# Altium schematic sheet Serwo.SchDoc
size A4; SheetNumber: 4; SheetTotal: 7
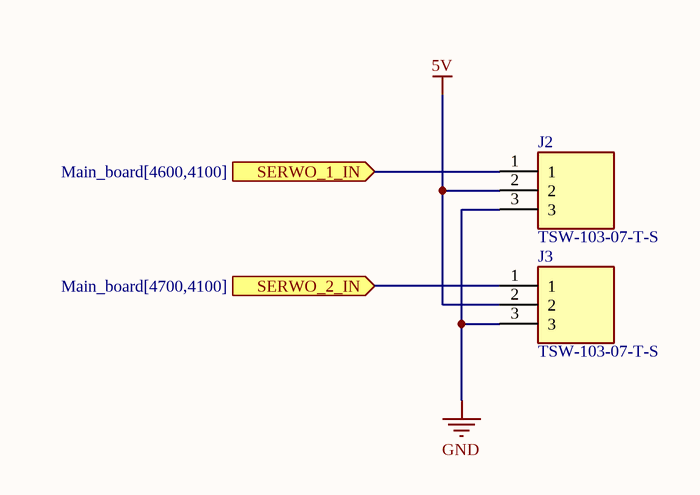
[diagram p0: Serwo.SchDoc]

## Parts
J2  TSW-103-07-T-S  [PCB 3 PIN PADS]
J3  TSW-103-07-T-S  [PCB 3 PIN PADS]

## Ports
SERWO_1_IN (in, see Main_board[4600,4100]), SERWO_2_IN (in, see Main_board[4700,4100])

## Nets
5V: J2.2 J3.2
GND: J2.3 J3.3
SERWO_1_IN: J2.1 ; port SERWO_1_IN
SERWO_2_IN: J3.1 ; port SERWO_2_IN

## Library data of the parts
J2 J3 = TSW-103-07-T-S: Connector; Manufacturer_Name: SAMTEC; Datasheet Link: http://suddendocs.samtec.com/prints/tsw-xxx-xx-xxx-x-xx-xxx-mkt.pdf; Manufacturer_Part_Number: TSW-103-07-T-S; Mouser Part Number: 200-TSW10307TS; Mouser Price/Stock: https://www.mouser.co.uk/ProductDetail/Samtec/TSW-103-07-T-S?qs=hzq9O0YpnZs1xDByQQIs%2FQ%3D%3D; Arrow Part Number: TSW-103-07-T-S; Arrow Price/Stock: https://www.arrow.com/en/products/tsw-103-07-t-s/samtec?region=nac